# Altium schematic sheet Sensor_Array_Large.SchDoc
size C
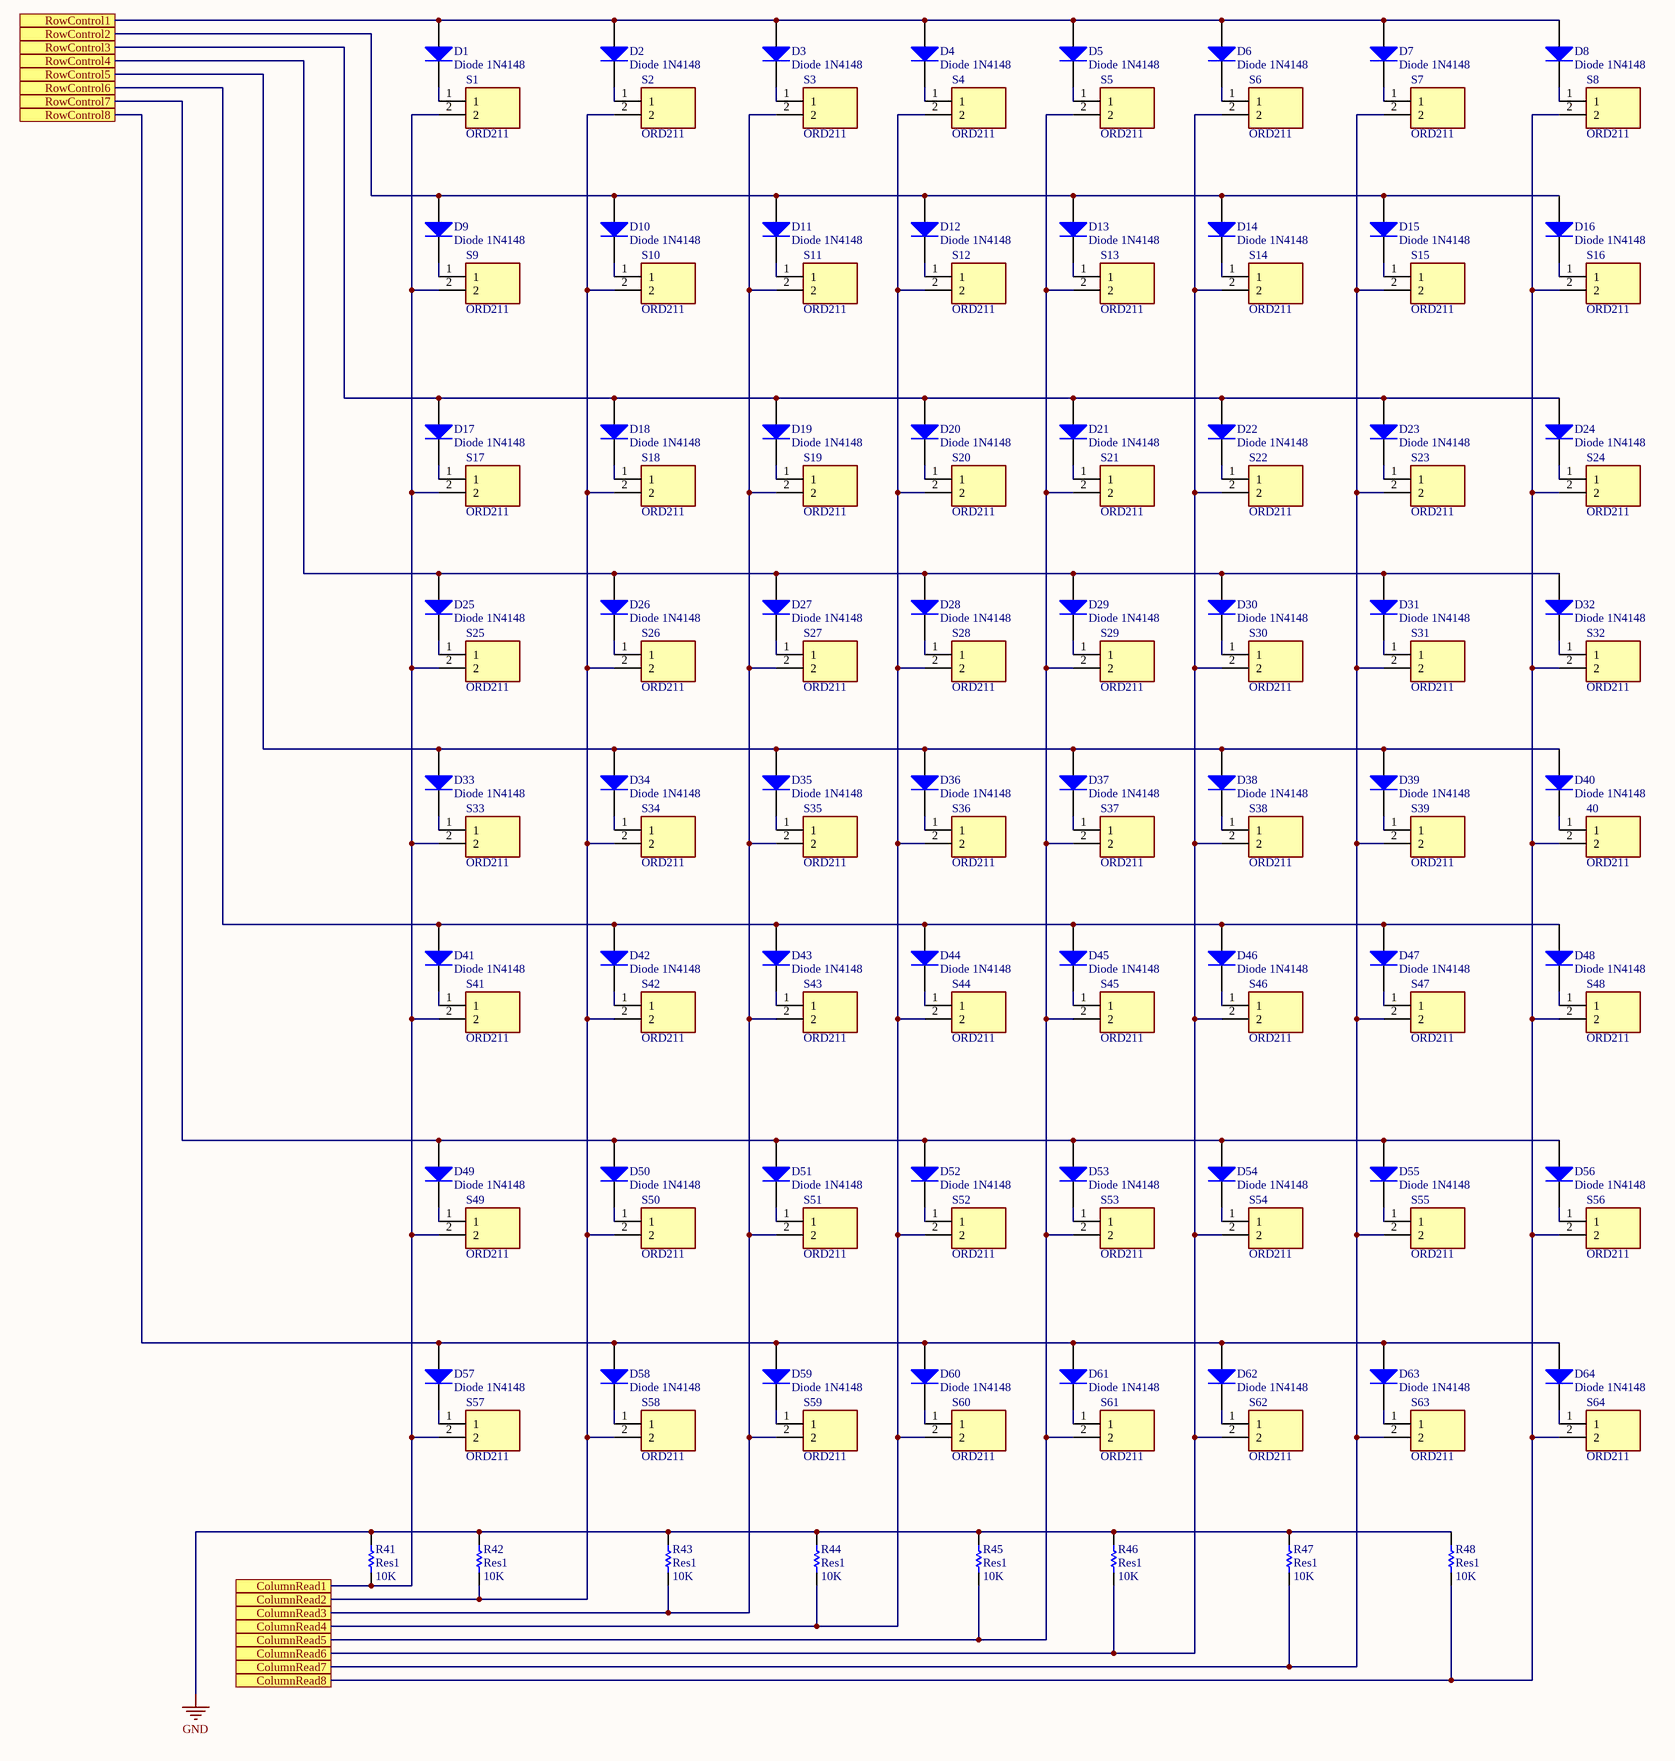
[diagram p0: Sensor_Array_Large.SchDoc]

## Parts
40  ORD211  [MDSM10R1025]
D1  Diode 1N4148  [DO-35]
D2  Diode 1N4148  [DO-35]
D3  Diode 1N4148  [DO-35]
D4  Diode 1N4148  [DO-35]
D5  Diode 1N4148  [DO-35]
D6  Diode 1N4148  [DO-35]
D7  Diode 1N4148  [DO-35]
D8  Diode 1N4148  [DO-35]
D9  Diode 1N4148  [DO-35]
D10  Diode 1N4148  [DO-35]
D11  Diode 1N4148  [DO-35]
D12  Diode 1N4148  [DO-35]
D13  Diode 1N4148  [DO-35]
D14  Diode 1N4148  [DO-35]
D15  Diode 1N4148  [DO-35]
D16  Diode 1N4148  [DO-35]
D17  Diode 1N4148  [DO-35]
D18  Diode 1N4148  [DO-35]
D19  Diode 1N4148  [DO-35]
D20  Diode 1N4148  [DO-35]
D21  Diode 1N4148  [DO-35]
D22  Diode 1N4148  [DO-35]
D23  Diode 1N4148  [DO-35]
D24  Diode 1N4148  [DO-35]
D25  Diode 1N4148  [DO-35]
D26  Diode 1N4148  [DO-35]
D27  Diode 1N4148  [DO-35]
D28  Diode 1N4148  [DO-35]
D29  Diode 1N4148  [DO-35]
D30  Diode 1N4148  [DO-35]
D31  Diode 1N4148  [DO-35]
D32  Diode 1N4148  [DO-35]
D33  Diode 1N4148  [DO-35]
D34  Diode 1N4148  [DO-35]
D35  Diode 1N4148  [DO-35]
D36  Diode 1N4148  [DO-35]
D37  Diode 1N4148  [DO-35]
D38  Diode 1N4148  [DO-35]
D39  Diode 1N4148  [DO-35]
D40  Diode 1N4148  [DO-35]
D41  Diode 1N4148  [DO-35]
D42  Diode 1N4148  [DO-35]
D43  Diode 1N4148  [DO-35]
D44  Diode 1N4148  [DO-35]
D45  Diode 1N4148  [DO-35]
D46  Diode 1N4148  [DO-35]
D47  Diode 1N4148  [DO-35]
D48  Diode 1N4148  [DO-35]
D49  Diode 1N4148  [DO-35]
D50  Diode 1N4148  [DO-35]
D51  Diode 1N4148  [DO-35]
D52  Diode 1N4148  [DO-35]
D53  Diode 1N4148  [DO-35]
D54  Diode 1N4148  [DO-35]
D55  Diode 1N4148  [DO-35]
D56  Diode 1N4148  [DO-35]
D57  Diode 1N4148  [DO-35]
D58  Diode 1N4148  [DO-35]
D59  Diode 1N4148  [DO-35]
D60  Diode 1N4148  [DO-35]
D61  Diode 1N4148  [DO-35]
D62  Diode 1N4148  [DO-35]
D63  Diode 1N4148  [DO-35]
D64  Diode 1N4148  [DO-35]
R41  Res1  value 10K  [AXIAL-0.3]
R42  Res1  value 10K  [AXIAL-0.3]
R43  Res1  value 10K  [AXIAL-0.3]
R44  Res1  value 10K  [AXIAL-0.3]
R45  Res1  value 10K  [AXIAL-0.3]
R46  Res1  value 10K  [AXIAL-0.3]
R47  Res1  value 10K  [AXIAL-0.3]
R48  Res1  value 10K  [AXIAL-0.3]
S1  ORD211  [MDSM10R1025]
S2  ORD211  [MDSM10R1025]
S3  ORD211  [MDSM10R1025]
S4  ORD211  [MDSM10R1025]
S5  ORD211  [MDSM10R1025]
S6  ORD211  [MDSM10R1025]
S7  ORD211  [MDSM10R1025]
S8  ORD211  [MDSM10R1025]
S9  ORD211  [MDSM10R1025]
S10  ORD211  [MDSM10R1025]
S11  ORD211  [MDSM10R1025]
S12  ORD211  [MDSM10R1025]
S13  ORD211  [MDSM10R1025]
S14  ORD211  [MDSM10R1025]
S15  ORD211  [MDSM10R1025]
S16  ORD211  [MDSM10R1025]
S17  ORD211  [MDSM10R1025]
S18  ORD211  [MDSM10R1025]
S19  ORD211  [MDSM10R1025]
S20  ORD211  [MDSM10R1025]
S21  ORD211  [MDSM10R1025]
S22  ORD211  [MDSM10R1025]
S23  ORD211  [MDSM10R1025]
S24  ORD211  [MDSM10R1025]
S25  ORD211  [MDSM10R1025]
S26  ORD211  [MDSM10R1025]
S27  ORD211  [MDSM10R1025]
S28  ORD211  [MDSM10R1025]
S29  ORD211  [MDSM10R1025]
S30  ORD211  [MDSM10R1025]
S31  ORD211  [MDSM10R1025]
S32  ORD211  [MDSM10R1025]
S33  ORD211  [MDSM10R1025]
S34  ORD211  [MDSM10R1025]
S35  ORD211  [MDSM10R1025]
S36  ORD211  [MDSM10R1025]
S37  ORD211  [MDSM10R1025]
S38  ORD211  [MDSM10R1025]
S39  ORD211  [MDSM10R1025]
S41  ORD211  [MDSM10R1025]
S42  ORD211  [MDSM10R1025]
S43  ORD211  [MDSM10R1025]
S44  ORD211  [MDSM10R1025]
S45  ORD211  [MDSM10R1025]
S46  ORD211  [MDSM10R1025]
S47  ORD211  [MDSM10R1025]
S48  ORD211  [MDSM10R1025]
S49  ORD211  [MDSM10R1025]
S50  ORD211  [MDSM10R1025]
S51  ORD211  [MDSM10R1025]
S52  ORD211  [MDSM10R1025]
S53  ORD211  [MDSM10R1025]
S54  ORD211  [MDSM10R1025]
S55  ORD211  [MDSM10R1025]
S56  ORD211  [MDSM10R1025]
S57  ORD211  [MDSM10R1025]
S58  ORD211  [MDSM10R1025]
S59  ORD211  [MDSM10R1025]
S60  ORD211  [MDSM10R1025]
S61  ORD211  [MDSM10R1025]
S62  ORD211  [MDSM10R1025]
S63  ORD211  [MDSM10R1025]
S64  ORD211  [MDSM10R1025]

## Ports
ColumnRead1, ColumnRead2, ColumnRead3, ColumnRead4, ColumnRead5, ColumnRead6, ColumnRead7, ColumnRead8, RowControl1, RowControl2, RowControl3, RowControl4, RowControl5, RowControl6, RowControl7, RowControl8

## Nets
GND: R41.2 R42.2 R43.2 R44.2 R45.2 R46.2 R47.2 R48.2
ColumnRead1: R41.1 S1.2 S9.2 S17.2 S25.2 S33.2 S41.2 S49.2 S57.2 ; port ColumnRead1
ColumnRead2: R42.1 S2.2 S10.2 S18.2 S26.2 S34.2 S42.2 S50.2 S58.2 ; port ColumnRead2
ColumnRead3: R43.1 S3.2 S11.2 S19.2 S27.2 S35.2 S43.2 S51.2 S59.2 ; port ColumnRead3
ColumnRead4: R44.1 S4.2 S12.2 S20.2 S28.2 S36.2 S44.2 S52.2 S60.2 ; port ColumnRead4
ColumnRead5: R45.1 S5.2 S13.2 S21.2 S29.2 S37.2 S45.2 S53.2 S61.2 ; port ColumnRead5
ColumnRead6: R46.1 S6.2 S14.2 S22.2 S30.2 S38.2 S46.2 S54.2 S62.2 ; port ColumnRead6
ColumnRead7: R47.1 S7.2 S15.2 S23.2 S31.2 S39.2 S47.2 S55.2 S63.2 ; port ColumnRead7
ColumnRead8: 40.2 R48.1 S8.2 S16.2 S24.2 S32.2 S48.2 S56.2 S64.2 ; port ColumnRead8
RowControl1: D1.1(A) D2.1(A) D3.1(A) D4.1(A) D5.1(A) D6.1(A) D7.1(A) D8.1(A) ; port RowControl1
RowControl2: D9.1(A) D10.1(A) D11.1(A) D12.1(A) D13.1(A) D14.1(A) D15.1(A) D16.1(A) ; port RowControl2
RowControl3: D17.1(A) D18.1(A) D19.1(A) D20.1(A) D21.1(A) D22.1(A) D23.1(A) D24.1(A) ; port RowControl3
RowControl4: D25.1(A) D26.1(A) D27.1(A) D28.1(A) D29.1(A) D30.1(A) D31.1(A) D32.1(A) ; port RowControl4
RowControl5: D33.1(A) D34.1(A) D35.1(A) D36.1(A) D37.1(A) D38.1(A) D39.1(A) D40.1(A) ; port RowControl5
RowControl6: D41.1(A) D42.1(A) D43.1(A) D44.1(A) D45.1(A) D46.1(A) D47.1(A) D48.1(A) ; port RowControl6
RowControl7: D49.1(A) D50.1(A) D51.1(A) D52.1(A) D53.1(A) D54.1(A) D55.1(A) D56.1(A) ; port RowControl7
RowControl8: D57.1(A) D58.1(A) D59.1(A) D60.1(A) D61.1(A) D62.1(A) D63.1(A) D64.1(A) ; port RowControl8
Net40_1: 40.1 D40.2(K)
NetD1_2: D1.2(K) S1.1
NetD2_2: D2.2(K) S2.1
NetD3_2: D3.2(K) S3.1
NetD4_2: D4.2(K) S4.1
NetD5_2: D5.2(K) S5.1
NetD6_2: D6.2(K) S6.1
NetD7_2: D7.2(K) S7.1
NetD8_2: D8.2(K) S8.1
NetD9_2: D9.2(K) S9.1
NetD10_2: D10.2(K) S10.1
NetD11_2: D11.2(K) S11.1
NetD12_2: D12.2(K) S12.1
NetD13_2: D13.2(K) S13.1
NetD14_2: D14.2(K) S14.1
NetD15_2: D15.2(K) S15.1
NetD16_2: D16.2(K) S16.1
NetD17_2: D17.2(K) S17.1
NetD18_2: D18.2(K) S18.1
NetD19_2: D19.2(K) S19.1
NetD20_2: D20.2(K) S20.1
NetD21_2: D21.2(K) S21.1
NetD22_2: D22.2(K) S22.1
NetD23_2: D23.2(K) S23.1
NetD24_2: D24.2(K) S24.1
NetD25_2: D25.2(K) S25.1
NetD26_2: D26.2(K) S26.1
NetD27_2: D27.2(K) S27.1
NetD28_2: D28.2(K) S28.1
NetD29_2: D29.2(K) S29.1
NetD30_2: D30.2(K) S30.1
NetD31_2: D31.2(K) S31.1
NetD32_2: D32.2(K) S32.1
NetD33_2: D33.2(K) S33.1
NetD34_2: D34.2(K) S34.1
NetD35_2: D35.2(K) S35.1
NetD36_2: D36.2(K) S36.1
NetD37_2: D37.2(K) S37.1
NetD38_2: D38.2(K) S38.1
NetD39_2: D39.2(K) S39.1
NetD41_2: D41.2(K) S41.1
NetD42_2: D42.2(K) S42.1
NetD43_2: D43.2(K) S43.1
NetD44_2: D44.2(K) S44.1
NetD45_2: D45.2(K) S45.1
NetD46_2: D46.2(K) S46.1
NetD47_2: D47.2(K) S47.1
NetD48_2: D48.2(K) S48.1
NetD49_2: D49.2(K) S49.1
NetD50_2: D50.2(K) S50.1
NetD51_2: D51.2(K) S51.1
NetD52_2: D52.2(K) S52.1
NetD53_2: D53.2(K) S53.1
NetD54_2: D54.2(K) S54.1
NetD55_2: D55.2(K) S55.1
NetD56_2: D56.2(K) S56.1
NetD57_2: D57.2(K) S57.1
NetD58_2: D58.2(K) S58.1
NetD59_2: D59.2(K) S59.1
NetD60_2: D60.2(K) S60.1
NetD61_2: D61.2(K) S61.1
NetD62_2: D62.2(K) S62.1
NetD63_2: D63.2(K) S63.1
NetD64_2: D64.2(K) S64.1

## Library data of the parts
40 S1-S39 S41-S64 = MDSM-10R-10-25: Switch; Manufacturer_Name: LITTELFUSE; Datasheet Link: https://www.littelfuse.com/~/media/electronics/datasheets/reed_switches/littelfuse_reed_switches_mdsm_10_datasheet.pdf.pdf; Height: 2mm; Manufacturer_Part_Number: MDSM-10R-10-25; Mouser Part Number: 934-MDSM-10R10-25; Mouser Price/Stock: https://www.mouser.co.uk/ProductDetail/Littelfuse/MDSM-10R-10-25?qs=nyo4TFax6Nce6Y4AmbWmcw%3D%3D; Arrow Part Number: MDSM-10R-10-25; Arrow Price/Stock: https://www.arrow.com/en/products/mdsm-10r-10-25/littelfuse
D1-D64 = Diode 1N4148: High Conductance Fast Diode; Published: 8-Jun-2000; LatestRevisionDate: 17-Jul-2002; LatestRevisionNote: Re-released for DXP Platform.; DatasheetVersion: 1997; PackageReference: DO-35; Publisher: Altium Limited; PackageDescription: Diode, Axial; Body 3.8 x 1.9 mm (LxDia. max), Lead Dia. 0.53 mm (max); Code_JEDEC: DO-204-AH; ComponentLink1Description: Manufacturer Link; ComponentLink1URL: http://www.fairchildsemi.com/; ComponentLink2Description: Datasheet; ComponentLink2URL: http://www.fairchildsemi.com/ds/1N%2F1N4148.pdf
R41-R48 = Res1: Resistor; Published: 8-Jun-2000; LatestRevisionDate: 17-Jul-2002; LatestRevisionNote: Re-released for DXP Platform.; PackageReference: AXIAL-0.3; Publisher: Altium Limited; PackageDescription: Axial Device, Thru-Hole; 2 Leads; 0.3 in Pin Spacing